# Altium schematic sheet Power Supply Adapter Schematic.schdoc
size 118 x 103 mm
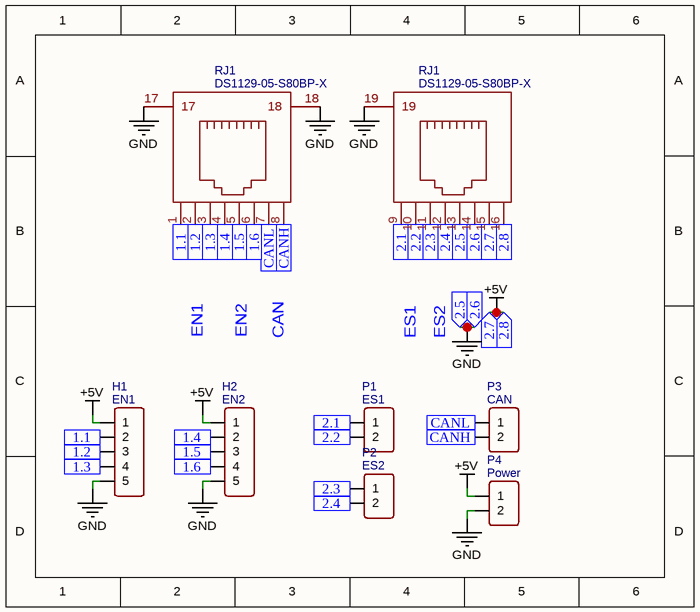
[diagram p0: Power Supply Adapter Schematic.schdoc]

## Parts
(Parts that share a designator on the sheet are numbered #1, #2 ... from top to bottom, then left to right.)
H1  EN1  [HDR-5X1/2.54]
H2  EN2  [HDR-5X1/2.54]
P1  ES1  [HDR-TH_2P-P2.54-V-M]
P2  ES2  [HDR-TH_2P-P2.54-V-M]
P3  CAN  [HDR-TH_2P-P2.54-V-M]
P4  Power  [HDR-TH_2P-P2.54-V-M]
RJ1#1  DS1129-05-S80BP-X  [RJ45-TH_DS1129-05-S80BP-X]
RJ1#2  DS1129-05-S80BP-X  [RJ45-TH_DS1129-05-S80BP-X]

## Ports
1.1 (in), 1.2 (in), 1.3 (in), 1.4 (in), 1.5 (in), 1.6 (in), 2.1 (in), 2.2 (in), 2.3 (in), 2.4 (in), 2.5 (in), 2.6 (in), 2.7 (in), 2.8 (in), CANH (in), CANL (in)

## Nets
+5V: H1.1 H2.1 P4.1 RJ1#2.15 RJ1#2.16 ; port 2.8, port 2.7
GND: H1.5 H2.5 P4.2 RJ1#1.17 RJ1#1.18 RJ1#2.13 RJ1#2.14 RJ1#2.19 ; port 2.5, port 2.6
1.1: H1.2 RJ1#1.1 ; port 1.1
1.2: H1.3 RJ1#1.2 ; port 1.2
1.3: H1.4 RJ1#1.3 ; port 1.3
1.4: H2.2 RJ1#1.4 ; port 1.4
1.5: H2.3 RJ1#1.5 ; port 1.5
1.6: H2.4 RJ1#1.6 ; port 1.6
2.1: P1.1 RJ1#2.9 ; port 2.1
2.2: P1.2 RJ1#2.10 ; port 2.2
2.3: P2.1 RJ1#2.11 ; port 2.3
2.4: P2.2 RJ1#2.12 ; port 2.4
CANH: P3.2 RJ1#1.8 ; port CANH
CANL: P3.1 RJ1#1.7 ; port CANL

## Notes on the sheet
- EN1
- EN2
- CAN
- ES1
- ES2

## Library data of the parts
H1 = EN1: BOM_Manufacturer: BOOMELE; BOM_Manufacturer Part: 2.54mm 1*5p Female header; BOM_Supplier: LCSC; image: //image.lceda.cn/szlcsc/C50950.jpg; BOM_Supplier Part: C50950; spicePre: H; spiceSymbolName: Header-Female-2.54_1x5
H2 = EN2: BOM_Manufacturer: BOOMELE; BOM_Manufacturer Part: 2.54mm 1*5p Female header; BOM_Supplier: LCSC; image: //image.lceda.cn/szlcsc/C50950.jpg; BOM_Supplier Part: C50950; spicePre: H; spiceSymbolName: Header-Female-2.54_1x5
P1 = ES1: BOM_Manufacturer: BOOMELE; BOM_Manufacturer Part: 2.54-1*2PFemale; BOM_Supplier: LCSC; image: //image.lceda.cn/szlcsc/C49661.jpg; BOM_Supplier Part: C49661; spicePre: P; spiceSymbolName: Header-Female-2.54_1x2
P2 = ES2: BOM_Manufacturer: BOOMELE; BOM_Manufacturer Part: 2.54-1*2PFemale; BOM_Supplier: LCSC; image: //image.lceda.cn/szlcsc/C49661.jpg; BOM_Supplier Part: C49661; spicePre: P; spiceSymbolName: Header-Female-2.54_1x2
P3 = CAN: BOM_Manufacturer: BOOMELE; BOM_Manufacturer Part: 2.54-1*2PFemale; BOM_Supplier: LCSC; image: //image.lceda.cn/szlcsc/C49661.jpg; BOM_Supplier Part: C49661; spicePre: P; spiceSymbolName: Header-Female-2.54_1x2
P4 = Power: BOM_Manufacturer: BOOMELE; BOM_Manufacturer Part: 2.54-1*2PFemale; BOM_Supplier: LCSC; image: //image.lceda.cn/szlcsc/C49661.jpg; BOM_Supplier Part: C49661; spicePre: P; spiceSymbolName: Header-Female-2.54_1x2
RJ1#1 RJ1#2 = DS1129-05-S80BP-X: BOM_Manufacturer: CONNFLY; BOM_Manufacturer Part: DS1129-05-S8B0P-X; subpart_no: 1; BOM_Supplier Part: C86580; BOM_Supplier: LCSC; spicePre: R; spiceSymbolName: DS1129-05-S80BP-X